# EAGLE design monitor_temperatura (EAGLE 6.5.0)
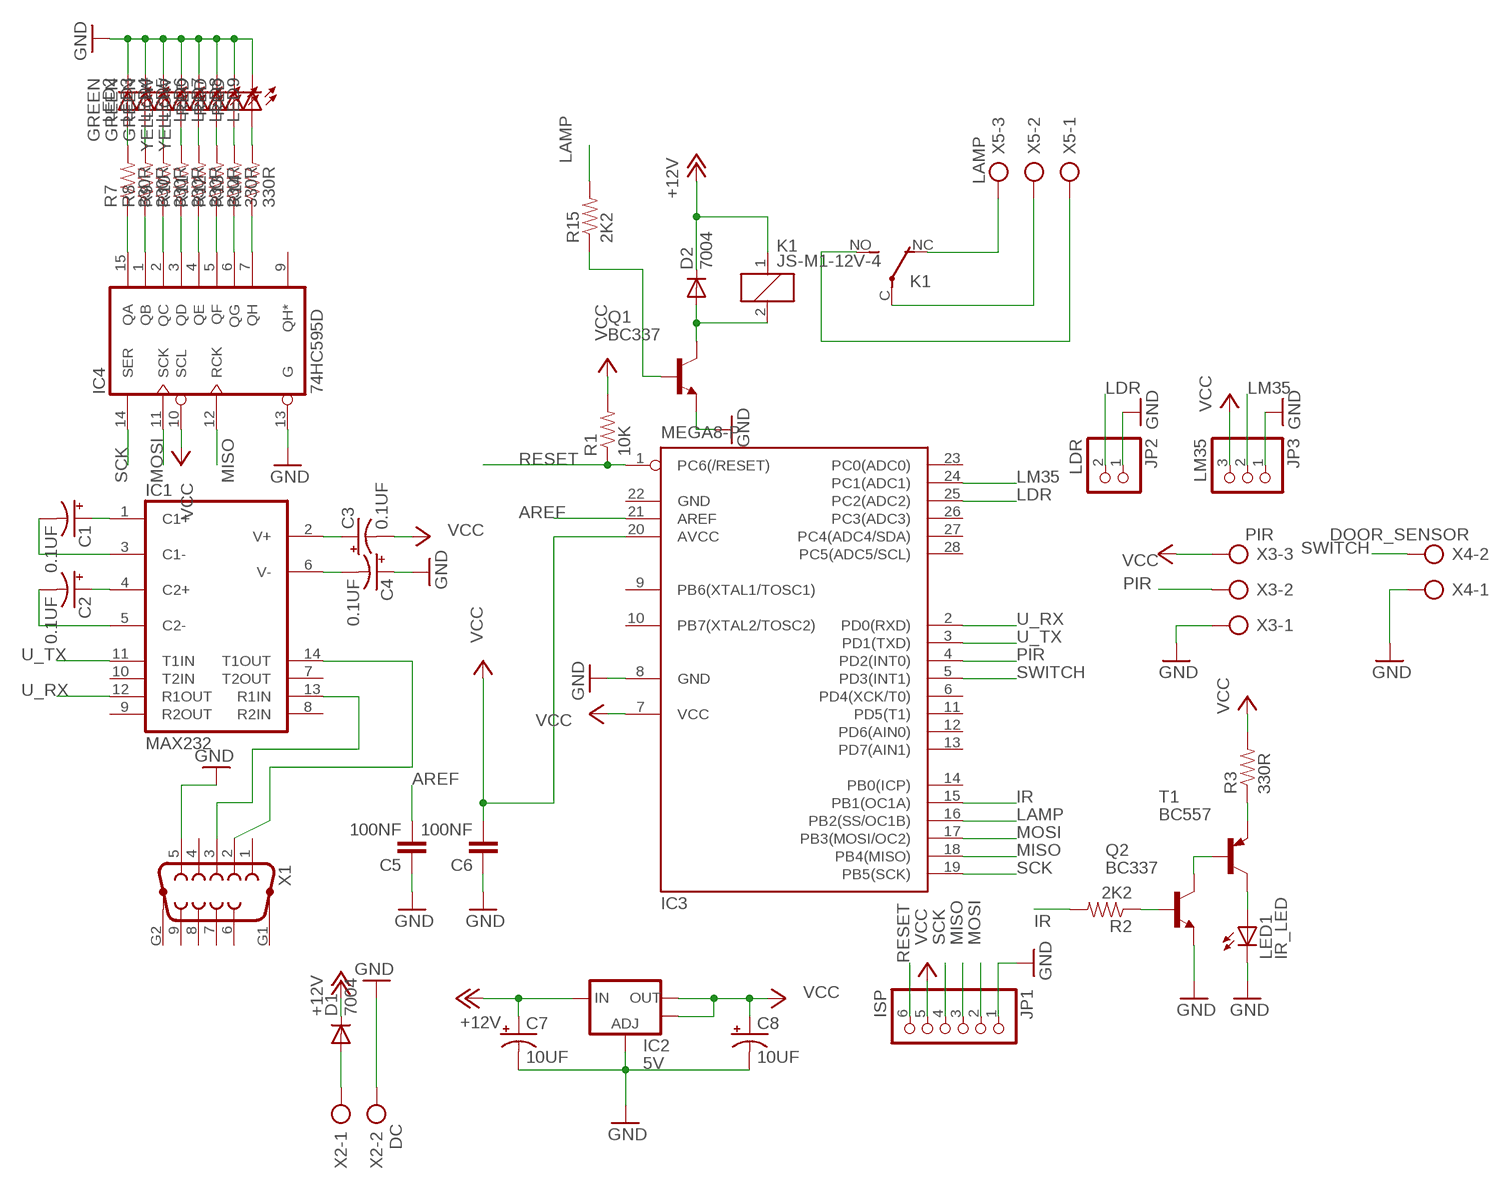
[diagram p0: schematic, sheet 1]

## Parts
C1  0.1UF  CAP_POLPTH2  [CPOL-RADIAL-10UF-25V]
C2  0.1UF  CAP_POLPTH2  [CPOL-RADIAL-10UF-25V]
C3  0.1UF  CAP_POLPTH2  [CPOL-RADIAL-10UF-25V]
C4  0.1UF  CAP_POLPTH2  [CPOL-RADIAL-10UF-25V]
C5  100NF  CAPEZ  [CAP-PTH-SMALLEZ]
C6  100NF  CAPEZ  [CAP-PTH-SMALLEZ]
C7  10UF  CAP_POLPTH2  [CPOL-RADIAL-10UF-25V]
C8  10UF  CAP_POLPTH2  [CPOL-RADIAL-10UF-25V]
D1  7004  DIODESMA-ALT  [SMA-DIODE_ALT]
D2  7004  DIODESMA-ALT  [SMA-DIODE_ALT]
IC1  MAX232  [DIL16]
IC2  5V  V_REG_LM1117SOT223  [SOT223]
IC3  MEGA8-P  [DIL28-3]
IC4  74HC595D  [SO16]
JP1  ISP  PINHD-1X6  [1X06]
JP2  LDR  PINHD-1X2  [1X02]
JP3  LM35  PINHD-1X3  [1X03]
K1  JS-M1-12V-4  [JS-M]
LED1  IR_LED  LED5MM  [LED5MM]
LED2  GREEN  LED5MM  [LED5MM]
LED3  GREEN  LED5MM  [LED5MM]
LED4  GREEN  LED5MM  [LED5MM]
LED5  YELLOW  LED5MM  [LED5MM]
LED6  YELLOW  LED5MM  [LED5MM]
LED7  RED  LED5MM  [LED5MM]
LED8  RED  LED5MM  [LED5MM]
LED9  RED  LED5MM  [LED5MM]
Q1  BC337  [TO92]
Q2  BC337  [TO92]
R1  10K  RESISTOR0805-RES  [0805]
R2  2K2  RESISTOR0805-RES  [0805]
R3  330R  RESISTOR0805-RES  [0805]
R7  330R  RESISTOR0805-RES  [0805]
R8  330R  RESISTOR0805-RES  [0805]
R9  330R  RESISTOR0805-RES  [0805]
R10  330R  RESISTOR0805-RES  [0805]
R11  330R  RESISTOR0805-RES  [0805]
R12  330R  RESISTOR0805-RES  [0805]
R13  330R  RESISTOR0805-RES  [0805]
R14  330R  RESISTOR0805-RES  [0805]
R15  2K2  RESISTOR0805-RES  [0805]
T1  BC557  [TO92]
X1  F09HP  [F09HP]
X2  DC  AK500/2-H  [AK500/2-H]
X3  PIR  AK500/3-H  [AK500/3-H]
X4  DOOR_SENSOR  AK500/2-H  [AK500/2-H]
X5  LAMP  AK500/3-H  [AK500/3-H]

## Nets
+12V: C7.1(+) D1.C D2.C IC2.3(IN) K1.1
AREF: C5.2 IC3.21(AREF)
GND: C4.1(+) C5.1 C6.1 C7.2(-) C8.2(-) IC2.1(ADJ) IC3.8(GND) IC4.13(G) JP1.1 JP2.1 JP3.1 LED1.K(C) LED2.K(C) LED3.K(C) LED4.K(C) LED5.K(C) LED6.K(C) LED7.K(C) LED8.K(C) LED9.K(C) Q1.1(E) Q2.1(E) X1.5 X2.2 X3.1 X4.1
IR: IC3.15(PB1(OC1A)) R2.2
LAMP: IC3.16(PB2(SS/OC1B)) R15.2
LDR: IC3.25(PC2(ADC2)) JP2.2
LM35: IC3.24(PC1(ADC1)) JP3.2
MISO: IC3.18(PB4(MISO)) IC4.12(RCK) JP1.3
MOSI: IC3.17(PB3(MOSI/OC2)) IC4.11(SCK) JP1.2
N$1: Q2.2(B) R2.1
N$2: Q2.3(C) T1.2(B)
N$3: R3.1 T1.1(E)
N$4: IC1.14(T1OUT) X1.2
N$5: IC1.13(R1IN) X1.3
N$6: C1.1(+) IC1.1(C1+)
N$7: C1.2(-) IC1.3(C1-)
N$8: C2.1(+) IC1.4(C2+)
N$9: C2.2(-) IC1.5(C2-)
N$10: C4.2(-) IC1.6(V-)
N$11: C3.1(+) IC1.2(V+)
N$12: D1.A X2.1
N$13: IC4.15(QA) R7.1
N$14: IC4.1(QB) R8.1
N$15: IC4.2(QC) R9.1
N$16: IC4.3(QD) R10.1
N$17: IC4.4(QE) R11.1
N$18: IC4.5(QF) R12.1
N$19: IC4.6(QG) R13.1
N$20: IC4.7(QH) R14.1
N$21: LED2.A R7.2
N$22: LED3.A R8.2
N$23: LED4.A R9.2
N$24: LED5.A R10.2
N$25: LED6.A R11.2
N$26: LED7.A R12.2
N$27: LED8.A R13.2
N$28: LED9.A R14.2
N$29: LED1.A T1.3(C)
N$30: K1.NC(2:O) X5.3
N$31: K1.NO(2:S) X5.1
N$32: K1.C(2:P) X5.2
N$33: D2.A K1.2 Q1.3(C)
N$35: Q1.2(B) R15.1
PIR: IC3.4(PD2(INT0)) X3.2
RESET: IC3.1(PC6(/RESET)) JP1.6 R1.1
SCK: IC3.19(PB5(SCK)) IC4.14(SER) JP1.4
SWITCH: IC3.5(PD3(INT1)) X4.2
U_RX: IC1.12(R1OUT) IC3.2(PD0(RXD))
U_TX: IC1.11(T1IN) IC3.3(PD1(TXD))
VCC: C3.2(-) C6.2 C8.1(+) IC2.2(OUT) IC2.4(OUT) IC3.7(VCC) IC3.20(AVCC) IC4.10(SCL) JP1.5 JP3.3 R1.2 R3.2 X3.3
Unconnected: IC1.7(T2OUT) IC1.8(R2IN) IC1.9(R2OUT) IC1.10(T2IN) IC3.6(PD4(XCK/T0)) IC3.9(PB6(XTAL1/TOSC1)) IC3.10(PB7(XTAL2/TOSC2)) IC3.11(PD5(T1)) IC3.12(PD6(AIN0)) IC3.13(PD7(AIN1)) IC3.14(PB0(ICP)) IC3.23(PC0(ADC0)) IC3.26(PC3(ADC3)) IC3.27(PC4(ADC4/SDA)) IC3.28(PC5(ADC5/SCL)) IC4.9(QH*) X1.1 X1.4 X1.6 X1.7 X1.8 X1.9 X1.G1 X1.G2

## Power pins joined to a net without a drawn wire
GND: IC1.15(GND) IC3.22(GND) IC4.8(GND)
VCC: IC1.16(VCC) IC4.16(VCC)

## Library data of the parts
C1-C4 C7 C8 = SparkFun-Capacitors:CAP_POL: Capacitor Polarized These are standard SMD and PTH capacitors. Normally 10uF, 47uF, and 100uF in electrolytic and tantalum varieties. Always verify the external diameter of the through hole cap, it varies with capacity, voltage, and manufacturer. The EIA devices should be standard.
C5 C6 = SparkFun-Capacitors:CAP: Capacitor Standard 0603 ceramic capacitor, and 0.1" leaded capacitor.
D1 D2 = SparkFun-DiscreteSemi:DIODE: Diode These are standard reverse protection diodes and small signal diodes. SMA package can handle up to about 1A. SOD-323 can handle about 200mA. What the SOD-323 package when ordering, there are some mfgs out there that are 5-pin packages.
IC1 = maxim:MAX232: RS232 TRANSCEIVER; MF: MAXIM; MPN: MAX232ACPE+; OC_FARNELL: 9723773; OC_NEWARK: 68K4544
IC2 = SparkFun-PowerIC:V_REG_LM1117: Voltage Regulator LM1117 Standard adjustable voltage regulator but in SMD form. Spark Fun Electronics SKU : COM-00595
IC3 = atmel:MEGA8-P: MICROCONTROLLER 8 Kbytes FLASH, 1 kbytes SRAM, 512 bytes EEPROM, USART, 4-channel 10 bit ADC, 2-channel 8 bit ADC Pin compatible with Atmega48, ATMega88, ATMega168 Source: avr.lbr; OC_FARNELL: unknown; OC_NEWARK: unknown
IC4 = 74xx-eu:74*595: 8-bit SHIFT REGISTER, output latch
JP1 = pinhead:PINHD-1X6: PIN HEADER
JP2 = pinhead:PINHD-1X2: PIN HEADER
JP3 = pinhead:PINHD-1X3: PIN HEADER
K1 = relay:JS-M1*: Automotive Ultra-Miniature Power Relay NAiS Source: http://www.mew-europe.com/.. en_ds_61211_0000.pdf; MPN: JSM1-12V-4; OC_FARNELL: 910338; OC_NEWARK: 13P4552
LED1-LED9 = led:LED: LED OSRAM: - CHIPLED LG R971, LG N971, LY N971, LG Q971, LY Q971, LO R971, LY R971 LH N974, LH R974 LS Q976, LO Q976, LY Q976 LO Q996 - Hyper CHIPLED LW Q18S LB Q993, LB Q99A, LB R99A - SideLED LS A670, LO A670, LY A670, LG A670, LP A670 LB A673, LV A673, LT A673, LW A673 LH A674 LY A675 LS A676, LA A676, LO A676, LY A676, LW A676 LS A679, LY A679, LG A679 - Hyper Micro SIDELED® LS Y876, LA Y876, LO Y876, LY Y876 LT Y87S - SmartLED LW L88C, LW L88S LB L89C, LB L89S, LG L890 LS L89K, LO L89K, LY L89K LS L896, LA L896, LO L896, LY L896 - TOPLED LS T670, LO T670, LY T670, LG T670, LP T670 LSG T670, LSP T670, LSY T670, LOP T670, LYG T670 LG T671, LOG T671, LSG T671 LB T673, LV T673, LT T673, LW T673 LH T674 LS T676, LA T676, LO T676, LY T676, LB T676, LH T676, LSB T676, LW T676 LB T67C, LV T67C, LT T67C, LS T67K, LO T67K, LY T67K, LW E67C LS E67B, LA E67B, LO E67B, LY E67B, LB E67C, LV E67C, LT E67C LW T67C LS T679, LY T679, LG T679 LS T770, LO T770, LY T770, LG T770, LP T770 LB T773, LV T773, LT T773, LW T773 LH T774 LS E675, LA E675, LY E675, LS T675 LS T776, LA T776, LO T776, LY T776, LB T776 LHGB T686 LT T68C, LB T68C - Hyper Mini TOPLED® LB M676 - Mini TOPLED Santana® LG M470 LS M47K, LO M47K, LY M47K Source: http://www.osram.convergy.de LUXEON: - LUMILED® LXK2-PW12-R00, LXK2-PW12-S00, LXK2-PW14-U00, LXK2-PW14-V00 LXK2-PM12-R00, LXK2-PM12-S00, LXK2-PM14-U00 LXK2-PE12-Q00, LXK2-PE12-R00, LXK2-PE12-S00, LXK2-PE14-T00, LXK2-PE14-U00 LXK2-PB12-K00, LXK2-PB12-L00, LXK2-PB12-M00, LXK2-PB14-N00, LXK2-PB14-P00, LXK2-PB14-Q00 LXK2-PR12-L00, LXK2-PR12-M00, LXK2-PR14-Q00, LXK2-PR14-R00 LXK2-PD12-Q00, LXK2-PD12-R00, LXK2-PD12-S00 LXK2-PH12-R00, LXK2-PH12-S00 LXK2-PL12-P00, LXK2-PL12-Q00, LXK2-PL12-R00 Source: www.luxeon.com KINGBRIGHT: KA-3528ASYC Source: www.kingbright.com
Q1 Q2 = transistor:BC337: NPN TRANSISTOR
R1-R3 R7-R15 = SparkFun-Passives:RESISTOR: Resistor Basic schematic elements and footprints for 0603, 1206, and PTH resistors.
T1 = transistor-pnp:BC557: PNP Transistor
X1 = con-subd:F09HP: SUB-D; OC_FARNELL: unknown; OC_NEWARK: unknown
X2 X4 = con-ptr500:AK500/2-H: CONNECTOR Aug. 2004 / PTR Meßtechnik: Die Bezeichnung der Serie AK505 wurde geändert. Es handelt sich hierbei um AK500 in horizontaler Ausführung.; OC_FARNELL: unknown; OC_NEWARK: unknown
X3 X5 = con-ptr500:AK500/3-H: CONNECTOR Aug. 2004 / PTR Meßtechnik: Die Bezeichnung der Serie AK505 wurde geändert. Es handelt sich hierbei um AK500 in horizontaler Ausführung.; OC_FARNELL: unknown; OC_NEWARK: unknown

## Board
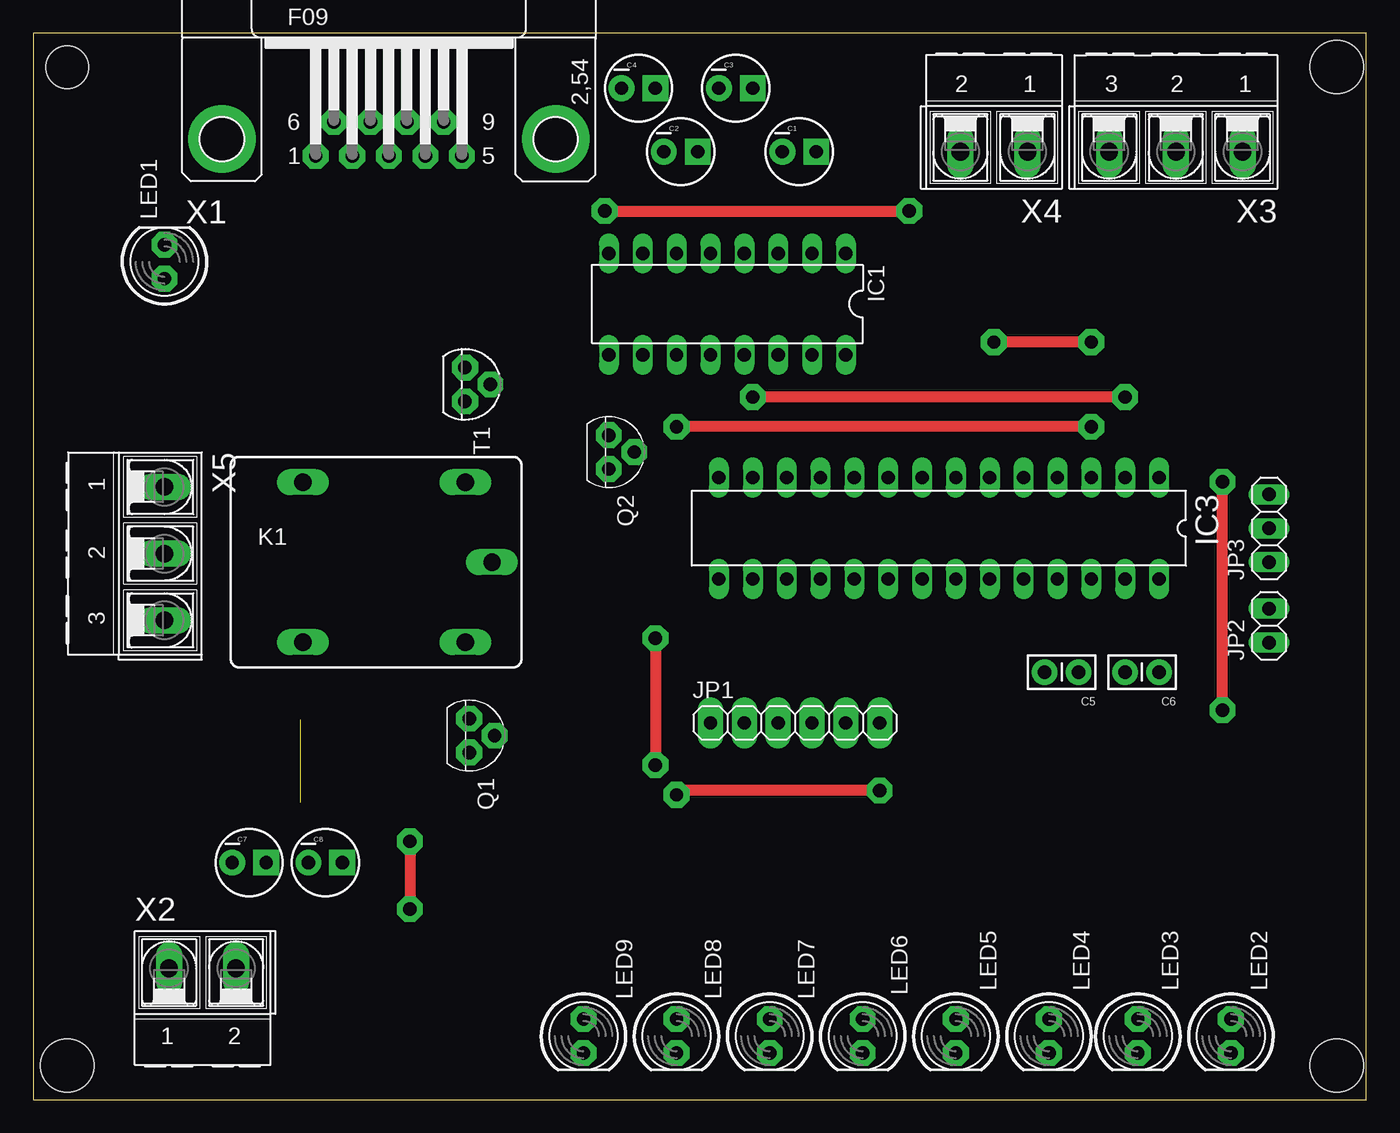
[diagram p1: board, top side]
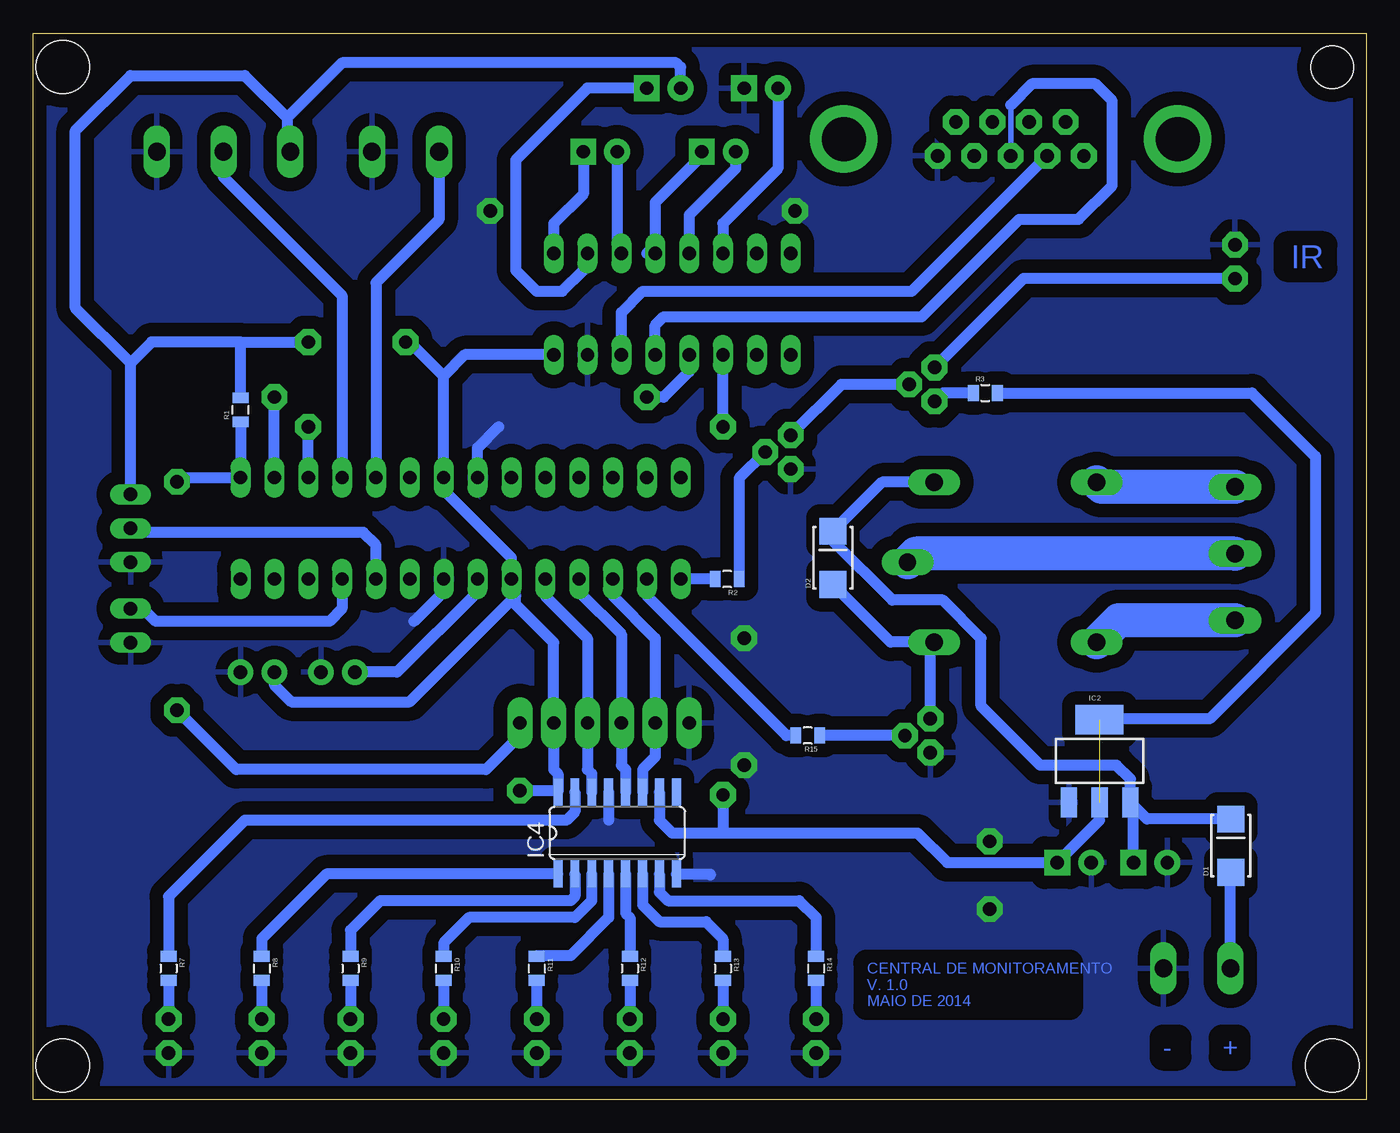
[diagram p2: board, bottom side, seen from below]

Size 100 x 80 mm. Coordinates in mm from the lower left corner, seen from the top.
Outline: 0,0 100,0 100,80 0,80 0,0
Copper layers (1*16): Top 0.035mm / dielectric 1.5mm / Bottom 0.035mm
Design rules "default *": minimum track width 32mil, minimum drill 1mm, track to track 8mil, track to pad 8mil, pad to pad 8mil, via to via 8mil, smd to smd 8mil, copper to edge 40mil, drill to drill 8mil, minimum pad ring 10mil, minimum via ring 8mil, stop-mask expansion 4mil, vias tented up to drill 0mil, thermal gap 36mil
Holes 4 mm at 2.54,2.54 97.79,2.54 97.79,77.47
Holes 3.2 mm at 2.54,77.47

### Footprints (pad centres in the part's own frame; a part is rotated, then mirrored left to right if it is on the bottom)
CPOL-RADIAL-10UF-25V = drill 1 pad 1.93 square: 1 1.27,0 | drill 1 pad 1.93: 2 -1.27,0
CAP-PTH-SMALLEZ = drill 1 pad 1.93: 1 0,0; 2 2.54,0
SMA-DIODE_ALT = smd 2 x 2: A -2,0; C 2,0
DIL16 = drill 1 long: 1 -8.89,-3.81; 2 -6.35,-3.81; 3 -3.81,-3.81; 4 -1.27,-3.81; 5 1.27,-3.81; 6 3.81,-3.81; 7 6.35,-3.81; 8 8.89,-3.81; 9 8.89,3.81; 10 6.35,3.81; 11 3.81,3.81; 12 1.27,3.81; 13 -1.27,3.81; 14 -3.81,3.81; 15 -6.35,3.81; 16 -8.89,3.81
SOT223 = smd 1.219 x 2.235: 1 -2.311,-3.099; 2 0,-3.099; 3 2.311,-3.099 | smd 3.6 x 2.2: 4 0,3.099
DIL28-3 = drill 1 long: 1 -16.51,-3.81; 2 -13.97,-3.81; 3 -11.43,-3.81; 4 -8.89,-3.81; 5 -6.35,-3.81; 6 -3.81,-3.81; 7 -1.27,-3.81; 8 1.27,-3.81; 9 3.81,-3.81; 10 6.35,-3.81; 11 8.89,-3.81; 12 11.43,-3.81; 13 13.97,-3.81; 14 16.51,-3.81; 15 16.51,3.81; 16 13.97,3.81; 17 11.43,3.81; 18 8.89,3.81; 19 6.35,3.81; 20 3.81,3.81; 21 1.27,3.81; 22 -1.27,3.81; 23 -3.81,3.81; 24 -6.35,3.81; 25 -8.89,3.81; 26 -11.43,3.81; 27 -13.97,3.81; 28 -16.51,3.81
SO16 = smd 0.66 x 2.032: 1 -4.445,-3.073; 2 -3.175,-3.073; 3 -1.905,-3.073; 4 -0.635,-3.073; 5 0.635,-3.073; 6 1.905,-3.073; 7 3.175,-3.073; 8 4.445,-3.073; 9 4.445,3.073; 10 3.175,3.073; 11 1.905,3.073; 12 0.635,3.073; 13 -0.635,3.073; 14 -1.905,3.073; 15 -3.175,3.073; 16 -4.445,3.073
1X06 = drill 1 pad 1.93 long: 1 -6.35,0; 2 -3.81,0; 3 -1.27,0; 4 1.27,0; 5 3.81,0; 6 6.35,0
1X02 = drill 1.016 long: 1 -1.27,0; 2 1.27,0
1X03 = drill 1.016 long: 1 -2.54,0; 2 0,0; 3 2.54,0
JS-M = drill 1.3 long: 1 6.7,6; 2 6.7,-6; C 8.7,0; NC -5.5,-6; NO -5.5,6
LED5MM = drill 1 pad 1.93 octagon: A -1.27,0; K 1.27,0
TO92 = drill 1 pad 1.93 octagon: 1 1.27,0; 2 0,1.905; 3 -1.27,0
0805 = smd 0.8 x 1.2: 1 -0.9,0; 2 0.9,0
F09HP = drill 1 pad 1.93 octagon: 1 -5.486,-1.27; 2 -2.743,-1.27; 3 0,-1.27; 4 2.743,-1.27; 5 5.486,-1.27; 6 -4.115,1.27; 7 -1.372,1.27; 8 1.372,1.27; 9 4.115,1.27 | drill 3.302 pad 5.08: G1 -12.522,0; G2 12.522,0
AK500/2-H = drill 1.321 long: 1 -2.515,0; 2 2.515,0
AK500/3-H = drill 1.321 long: 1 -5.004,0; 2 0,0; 3 5.004,0

### Placement (x,y rotation side)
C1  57.47,71.12 0 top
C2  48.58,71.12 0 top
C3  52.7,75.88 0 top
C4  45.4,75.88 0 top
C5  78.42,32.07 180 top
C6  84.45,32.07 180 top
C7  16.19,17.78 0 top
C8  21.91,17.78 0 top
D1  10.16,19.05 90 bottom
D2  40.01,40.64 90 bottom
IC1  52.07,59.69 180 top
IC2  20,25.4 0 bottom
IC3  67.94,42.86 180 top
IC4  56.2,20 0 bottom
JP1  57.15,28.26 0 top
JP2  92.71,35.56 90 top
JP3  92.71,42.86 90 top
K1  25.72,40.32 0 top
LED1  9.84,62.87 90 top
LED2  89.85,4.76 270 top
LED3  82.87,4.76 270 top
LED4  76.2,4.76 270 top
LED5  69.22,4.76 270 top
LED6  62.23,4.76 270 top
LED7  55.24,4.76 270 top
LED8  48.26,4.76 270 top
LED9  41.27,4.76 270 top
Q1  32.7,27.3 270 top
Q2  43.18,48.58 270 top
R1  84.45,51.75 90 bottom
R2  47.94,39.05 180 bottom
R3  28.57,53.02 0 bottom
R7  89.85,9.84 270 bottom
R8  82.87,9.84 270 bottom
R9  76.2,9.84 270 bottom
R10  69.22,9.84 270 bottom
R11  62.23,9.84 270 bottom
R12  55.24,9.84 270 bottom
R13  48.26,9.84 270 bottom
R14  41.27,9.84 270 bottom
R15  41.91,27.3 180 bottom
T1  32.38,53.66 270 top
X1  26.67,72.07 0 top
X2  12.7,9.84 0 top
X3  85.72,71.12 180 top
X4  72.07,71.12 180 top
X5  9.84,40.96 270 top

### Tracks (layer width: path | path; a pad name or v marks a point on that pad's centre or on a via)
+12V
  Bottom 0.813: D1.C 16.44,21.05 IC2.3 | C7.1 17.46,22.07 IC2.3 | K1.1 36.32,46.32 D2.C 40.01,41.91 35.56,37.47 31.75,37.47 28.89,34.61 28.89,29.53 24.45,25.08 18.73,25.08 17.69,24.04 IC2.3
AREF
  Bottom 0.813: IC3.21 66.67,38.1 72.71,32.07 C5.2
GND  (via drill 1 pad 1.93)
  Top 0.813: v46.67,34.61 v46.67,25.08 | v28.26,19.37 v28.26,14.29 | v42.86,66.67 v65.72,66.67
  Bottom 0.813: IC4.13 56.83,20.95 | IC3.22 69.22,38.1 71.44,35.88 | IC3.8 66.67,48.9 65.09,50.48 | IC4.8 49.21,16.93 49.21,16.83
  pour Bottom (isolate 1.016): 0.32,79.38 99.69,79.38 99.69,0 0.32,0
IR
  Bottom 0.813: R2.2 IC3.15
LAMP
  Bottom 0.813: R15.2 43.5,27.3 53.98,37.78 IC3.16
LDR
  Bottom 0.813: IC3.25 76.83,36.83 77.79,35.88 90.81,35.88 92.08,37.15 92.39,37.15 JP2.2
LM35
  Bottom 0.813: IC3.24 74.3,41.59 75.25,42.55 92.39,42.55 JP3.2
MISO
  Bottom 0.813: IC4.12 55.56,24.77 55.88,25.08 JP1.3 55.88,34.92 59.05,38.1 IC3.18
MOSI
  Bottom 0.813: IC4.11 54.29,24.77 53.34,25.72 JP1.2 53.34,34.61 56.52,37.78 IC3.17
N$1
  Bottom 0.813: Q2.2 47.04,46.62 R2.1
N$2
  Bottom 0.813: T1.2 39.37,53.66 Q2.3
N$3
  Bottom 0.813: R3.1 31.75,53.02 T1.1
N$4
  Bottom 0.813: IC1.14 55.88,56.83 55.88,59.05 54.29,60.64 34.09,60.64 X1.2
N$5
  Bottom 0.406: 26.67,74.61 X1.3
  Bottom 0.813: IC1.13 53.34,56.52 53.34,58.1 52.7,58.74 33.34,58.74 26.04,66.04 21.59,66.04 19.05,68.58 19.05,74.93 20.32,76.2 25.08,76.2 26.67,74.61
N$6
  Bottom 0.813: C1.1 58.74,67.94 60.96,65.72 IC1.1
N$7
  Bottom 0.813: C1.2 56.2,63.82 IC1.3
N$8
  Bottom 0.813: C2.1 49.85,70.8 53.34,67.31 53.34,64.14 53.98,63.5 IC1.4
N$9
  Bottom 0.813: C2.2 47.31,69.85 50.8,66.36 IC1.5
N$10
  Bottom 0.813: C4.2 44.13,69.85 48.26,65.72 IC1.6
N$11
  Bottom 0.813: C3.1 58.42,75.88 63.82,70.48 63.82,62.23 62.23,60.64 60.33,60.64 58.74,62.23 58.74,63.18 IC1.2
N$12
  Bottom 0.813: X2.1 10.19,17.02 D1.A
N$13
  Bottom 0.813: IC4.15 59.37,21.59 60.01,20.95 84.14,20.95 89.85,15.24 R7.1
N$14
  Bottom 0.813: IC4.1 78,16.93 82.87,12.06 R8.1
N$15
  Bottom 0.813: IC4.2 59.37,15.24 59.69,14.92 73.98,14.92 76.2,12.7 R9.1
N$16
  Bottom 0.813: IC4.3 58.1,14.92 59.37,13.65 67.31,13.65 69.22,11.75 R10.1
N$17
  Bottom 0.61: 62.18,10.79 R11.1
  Bottom 0.813: IC4.4 56.83,13.65 59.69,10.79 62.18,10.79
N$18
  Bottom 0.813: IC4.5 55.56,13.97 55.24,13.65 R12.1
N$19
  Bottom 0.813: IC4.6 54.29,14.61 53.02,13.34 49.53,13.34 48.26,12.06 R13.1
N$20
  Bottom 0.813: IC4.7 53.02,15.56 52.39,14.92 42.55,14.92 41.27,13.65 R14.1
N$21
  Bottom 0.813: R7.2 LED2.A
N$22
  Bottom 0.813: R8.2 LED3.A
N$23
  Bottom 0.813: R9.2 LED4.A
N$24
  Bottom 0.813: R10.2 LED5.A
N$25
  Bottom 0.813: R11.2 LED6.A
N$26
  Bottom 0.813: R12.2 LED7.A 55.56,5.71
N$27
  Bottom 0.813: R13.2 LED8.A
N$28
  Bottom 0.813: R14.2 LED9.A
N$29
  Bottom 0.813: LED1.A 25.72,61.59 T1.3
N$30
  Bottom 2.54: X5.3 18.59,35.95 K1.NC
N$31
  Bottom 2.54: X5.1 19.86,45.96 K1.NO
N$32
  Bottom 2.54: X5.2 33.78,40.96 K1.C
N$33
  Bottom 0.813: Q1.3 32.7,34.04 K1.2 35.69,34.32 D2.A
N$35
  Bottom 0.813: Q1.2 R15.1
PIR
  Bottom 0.813: X3.2 85.72,69.22 76.83,60.33 IC3.4
RESET  (via drill 1 pad 1.93)
  Top 0.813: v89.22,29.21 v89.22,46.35
  Bottom 0.813: R1.1 IC3.1 88.9,46.67 v89.22,46.35 | JP1.6 63.5,27.3 66.04,24.77 84.77,24.77 v89.22,29.21
SCK
  Bottom 0.813: IC4.14 58.1,24.45 58.42,24.77 JP1.4 58.42,34.61 61.59,37.78 IC3.19
SWITCH
  Bottom 0.813: X4.2 69.56,66.02 74.3,61.28 IC3.5
U_RX  (via drill 1 pad 1.93)
  Top 0.813: v81.92,52.7 v53.98,52.7
  Bottom 0.813: IC3.2 v81.92,52.7 | IC1.12 50.8,54.61 52.7,52.7 v53.98,52.7
U_TX  (via drill 1 pad 1.93)
  Top 0.813: v79.38,50.48 v48.26,50.48
  Bottom 0.813: IC3.3 v79.38,50.48 | v48.26,50.48 IC1.11
VCC  (via drill 1 pad 1.93)  (1 unrouted)
  Top 0.813: v79.38,56.83 v72.07,56.83 71.75,56.83 | v63.5,23.18 48.58,23.18 v48.26,22.86
  Bottom 0.813: C3.2 51.44,77.47 51.75,77.79 76.83,77.79 80.96,73.66 | 80.96,73.66 80.96,71.36 X3.3 | IC2.2 20,20.95 C8.1 31.43,17.78 33.66,20 48.26,20 | R3.2 8.57,53.02 3.81,48.26 3.81,36.51 11.75,28.57 19.93,28.57 IC2.4 | IC4.10 53.02,20.95 52.07,20 48.26,20 | 63.82,37.78 63.82,37.15 60.96,34.29 JP1.5 60.96,24.77 60.64,24.45 IC4.16 60.74,23.18 v63.5,23.18 | 63.82,37.78 63.82,38.73 IC3.20 64.14,40.64 69.22,45.72 IC3.7 69.22,54.29 | JP3.3 92.71,55.24 | 92.71,55.24 96.84,59.37 96.84,72.71 92.71,76.83 84.14,76.83 80.96,73.66 | 84.45,56.83 91.12,56.83 92.71,55.24 | R1.2 84.45,56.83 | 84.45,56.83 v79.38,56.83 | 69.22,54.29 71.75,56.83 v72.07,56.83 | C6.2 81.92,31.11 80.64,29.84 71.75,29.84 63.82,37.78 | IC1.16 67.63,55.88 69.22,54.29 | v48.26,22.86 48.26,20

### Text on the board
Bottom: IR | CENTRAL DE MONITORAMENTO / V. 1.0 / MAIO DE 2014 | + | -